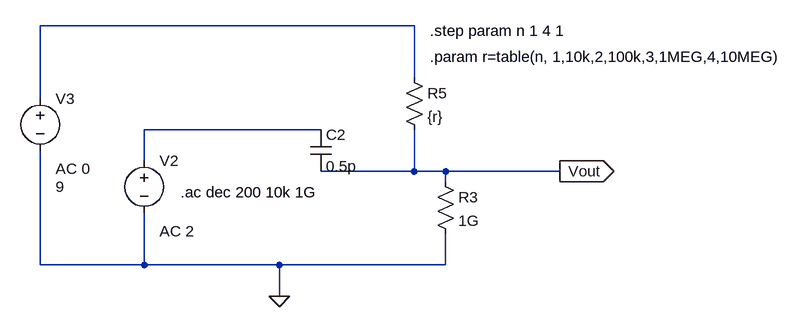
[diagram p0: schematic Input.asc]
Input.asc, the LTspice schematic file:
Version 4
SHEET 1 880 680
WIRE -448 -176 -1024 -176
WIRE -448 -96 -448 -176
WIRE -1024 -64 -1024 -176
WIRE -592 -16 -864 -16
WIRE -864 32 -864 -16
WIRE -448 48 -448 -16
WIRE -448 48 -592 48
WIRE -400 48 -448 48
WIRE -224 48 -400 48
WIRE -400 64 -400 48
WIRE -1024 192 -1024 16
WIRE -864 192 -864 112
WIRE -864 192 -1024 192
WIRE -656 192 -864 192
WIRE -400 192 -400 144
WIRE -400 192 -656 192
WIRE -656 240 -656 192
FLAG -656 240 0
FLAG -224 48 Vout
IOPIN -224 48 Out
SYMBOL voltage -864 16 R0
WINDOW 123 24 124 Left 2
WINDOW 39 0 0 Left 0
SYMATTR InstName V2
SYMATTR Value ""
SYMATTR Value2 AC 2
SYMBOL cap -608 -16 R0
SYMATTR InstName C2
SYMATTR Value 0.5p
SYMBOL res -416 48 R0
SYMATTR InstName R3
SYMATTR Value 1G
SYMBOL voltage -1024 -80 R0
WINDOW 3 24 152 Left 2
WINDOW 123 24 124 Left 2
WINDOW 39 0 0 Left 0
SYMATTR InstName V3
SYMATTR Value 9
SYMATTR Value2 AC 0
SYMBOL res -464 -112 R0
SYMATTR InstName R5
SYMATTR Value {r}
TEXT -424 -128 Left 2 !.param r=table(n, 1,10k,2,100k,3,1MEG,4,10MEG)
TEXT -424 -168 Left 2 !.step param n 1 4 1
TEXT -808 80 Left 2 !.ac dec 200 10k 1G

The netlist it stands for:
* Input.asc
V2 N002 0 AC 2
C2 N002 Vout 0.5p
R3 Vout 0 1G
V3 N001 0 9 AC 0
R5 N001 Vout {r}
.param r=table(n, 1,10k,2,100k,3,1MEG,4,10MEG)
.step param n 1 4 1
.ac dec 200 10k 1G
.backanno
.end

* Results of the author's LTspice run, read from the files saved beside the schematic
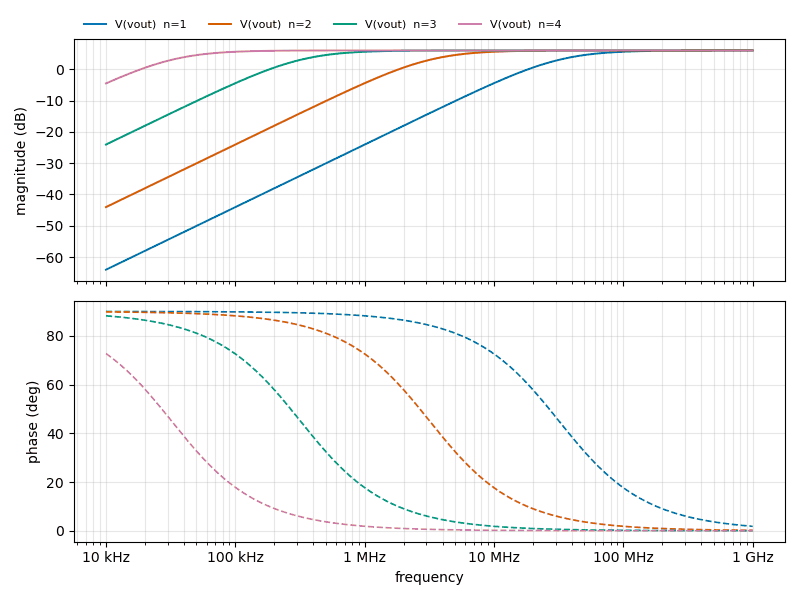
[diagram p1: AC Analysis of Input.asc, plotted from the saved traces]
* AC Analysis, 4 runs:
*   V(vout) [n=1]: -64.04 dB at 10 kHz, 6.02 dB at 1 GHz, peak 6.02 dB at 1 GHz, 3 dB below the peak at 31.8 MHz
*   V(vout) [n=2]: -44.04 dB at 10 kHz, 6.02 dB at 1 GHz, peak 6.02 dB at 1 GHz, 3 dB below the peak at 3.183 MHz
*   V(vout) [n=3]: -24.05 dB at 10 kHz, 6.02 dB at 1 GHz, peak 6.02 dB at 1 GHz, 3 dB below the peak at 318.6 kHz
*   V(vout) [n=4]: -4.52 dB at 10 kHz, 6.02 dB at 1 GHz, peak 6.02 dB at 1 GHz, 3 dB below the peak at 32.15 kHz